# Altium schematic sheet 03.SchDoc
size 420 x 297 mm
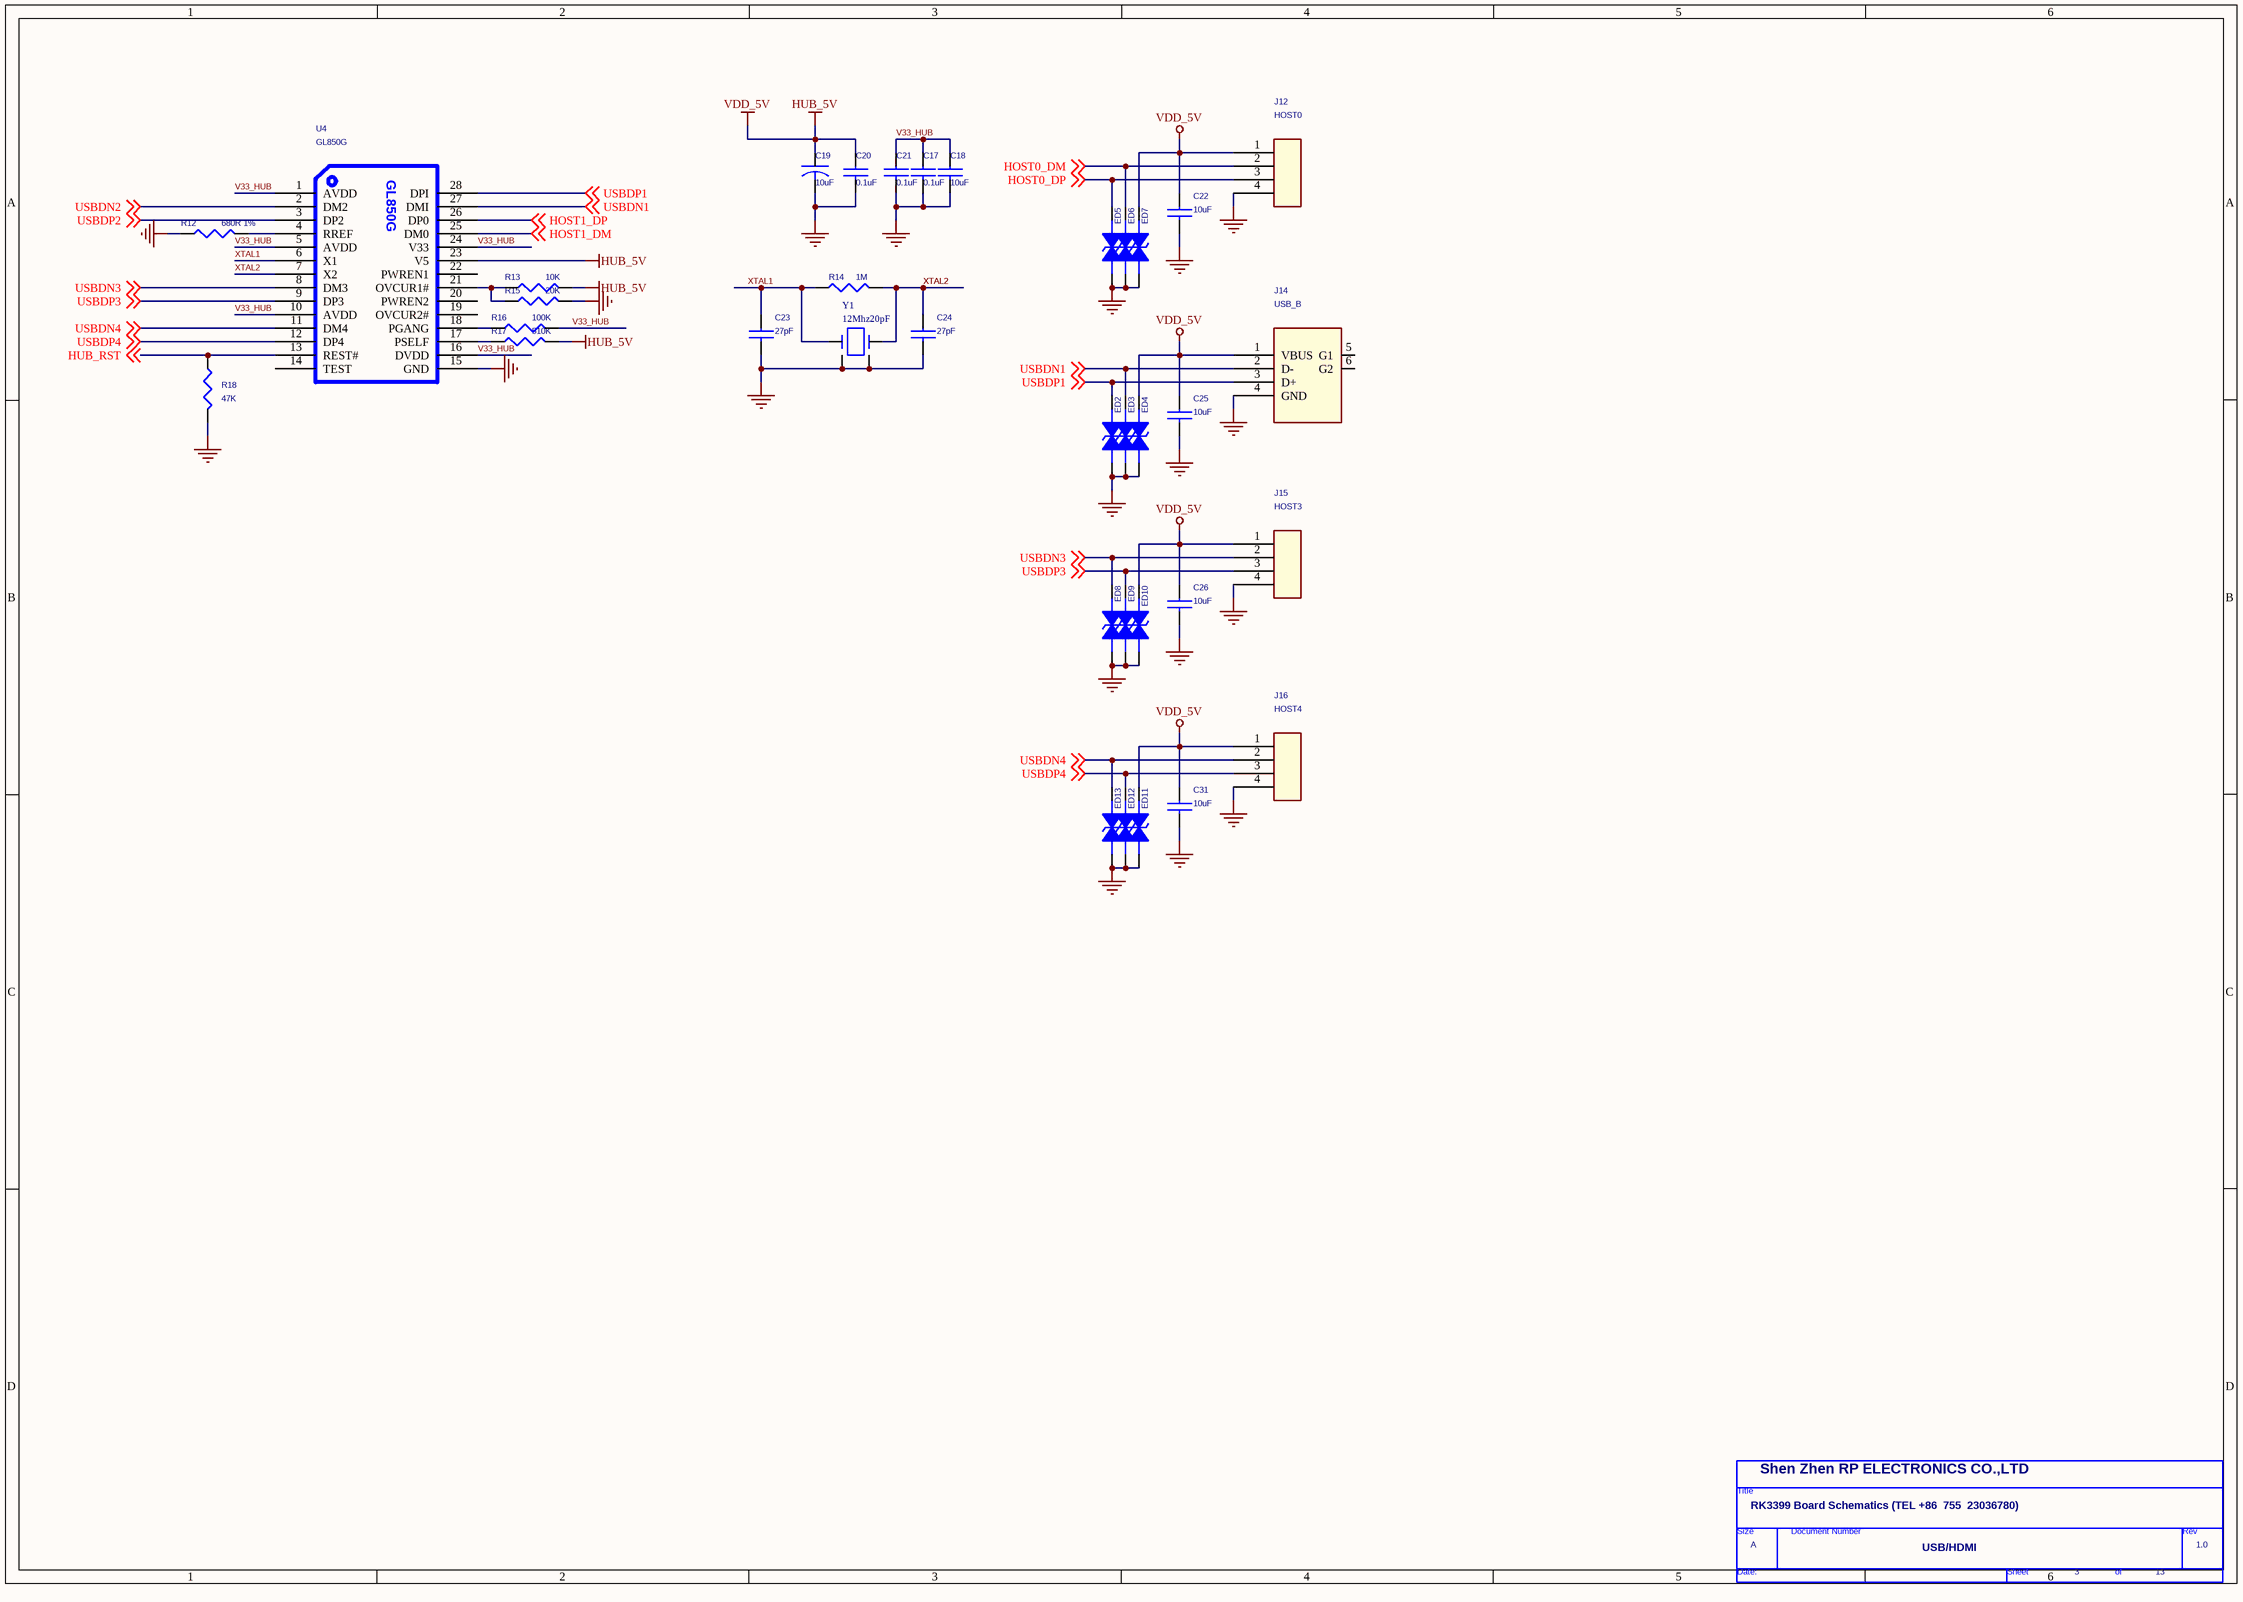
[diagram p0: 03.SchDoc]

## Parts
*  Doc: USB/HDMI  RevCode: 1.0  Title: RK3399 Board Schematics (TEL +86  755  23036780)  Page Size: A  Page Number: 3  Page Count: 13  Cage Code: Shen Zhen RP ELECTRONICS CO.,LTD  (hidden comment: TitleBlock0)  (graphical)
C17  0.1uF  [0805C]
C18  10uF  [0805C]
C19  10uF  [0805C]
C20  0.1uF  [0805C]
C21  0.1uF  [0805C]
C22  10uF  [0805C]
C23  27pF  [0805C]
C24  27pF  [0805C]
C25  10uF  [0805C]
C26  10uF  [0805C]
C31  10uF  [0805C]
ED2  ESD  [SOD-323]  (value not drawn)
ED3  ESD  [SOD-323]  (value not drawn)
ED4  ESD  [SOD-323]  (value not drawn)
ED5  ESD  [SOD-323]  (value not drawn)
ED6  ESD  [SOD-323]  (value not drawn)
ED7  ESD  [SOD-323]  (value not drawn)
ED8  ESD  [SOD-323]  (value not drawn)
ED9  ESD  [SOD-323]  (value not drawn)
ED10  ESD  [SOD-323]  (value not drawn)
ED11  ESD  [SOD-323]  (value not drawn)
ED12  ESD  [SOD-323]  (value not drawn)
ED13  ESD  [SOD-323]  (value not drawn)
J12  HOST0  [USB-A]
J14  USB_B  [USB-A]
J15  HOST3  [USB-A]
J16  HOST4  [USB-A]
R12  680R 1%  [0805]
R13  10K  [0805]
R14  1M  [0805]
R15  20K  [0805]
R16  100K  [0805]
R17  510K  [0805]
R18  47K  [0805]
U4  GL850G  [GL850G]
Y1  12Mhz20pF  [Y3025]

## Nets
GND: C17.2 C18.2 C19.2 C20.2 C21.2 C22.2 C23.2 C24.2 C25.2 C26.2 C31.2 ED2.2 ED3.2 ED4.2 ED5.2 ED6.2 ED7.2 ED8.2 ED9.2 ED10.2 ED11.2 ED12.2 ED13.2 J12.4 J14.4(GND) J15.4 J16.4 R12.1 R15.2 R18.2 U4.15(GND) Y1.2 Y1.4
HUB_5V: C19.1 C20.1 C22.1 C25.1 C26.1 C31.1 ED4.1 ED7.1 ED10.1 ED11.1 J12.1 J14.1(VBUS) J15.1 J16.1 R13.2 R17.2 U4.23(V5)  [also labelled VDD_5V]
HOST0_DM: ED6.1 J12.2 ; off-sheet HOST0_DM
HOST0_DP: ED5.1 J12.3 ; off-sheet HOST0_DP
HOST1_DM: U4.25(DM0) ; off-sheet HOST1_DM
HOST1_DP: U4.26(DP0) ; off-sheet HOST1_DP
HUB_RST: R18.1 U4.13(REST#) ; off-sheet HUB_RST
USBDN1: ED3.1 J14.2(D-) U4.27(DMI) ; off-sheet USBDN1
USBDN2: U4.2(DM2) ; off-sheet USBDN2
USBDN3: ED8.1 J15.2 U4.8(DM3) ; off-sheet USBDN3
USBDN4: ED13.1 J16.2 U4.11(DM4) ; off-sheet USBDN4
USBDP1: ED2.1 J14.3(D+) U4.28(DPI) ; off-sheet USBDP1
USBDP2: U4.3(DP2) ; off-sheet USBDP2
USBDP3: ED9.1 J15.3 U4.9(DP3) ; off-sheet USBDP3
USBDP4: ED12.1 J16.3 U4.12(DP4) ; off-sheet USBDP4
V33_HUB: C17.1 C18.1 C21.1 R16.2 U4.1(AVDD) U4.5(AVDD) U4.10(AVDD) U4.16(DVDD) U4.24(V33)
XTAL1: C23.1 R14.2 U4.6(X1) Y1.1
XTAL2: C24.1 R14.1 U4.7(X2) Y1.3
NetR12_2: R12.2 U4.4(RREF)
NetR13_1: R13.1 R15.1 U4.21(OVCUR1#)
NetR16_1: R16.1 U4.18(PGANG)
NetR17_1: R17.1 U4.17(PSELF)

Not connected (* = marked no-connect by the designer): J14 5(G1) 6(G2); U4 14(TEST) 19(OVCUR2#) 20(PWREN2) 22(PWREN1)

## Notes on the sheet
- (in symbol TitleBlock0) Title; Size; Document Number; Rev; Date:; Sheet; of

## Library data of the parts
C17 C18 C20 C21 = CAP NP_Dup5
C19 = CAP_Dup1
C22 C25 C26 C31 = CAP NP_Dup8
C23 C24 = CAP NP_3_Dup1
ED2-ED13 = DIODE BI-DIR TRIG
J12 J15 J16 = CON4
J14 = USB_A_1
R12 = 01RES
R13 R15-R18 = R_1
R14 = RES_0
U4 = FE1_1s_SSOP28_1
Y1 = CRYSTAL_2
* = TitleBlock0: Page Create Date: March  8, 1995